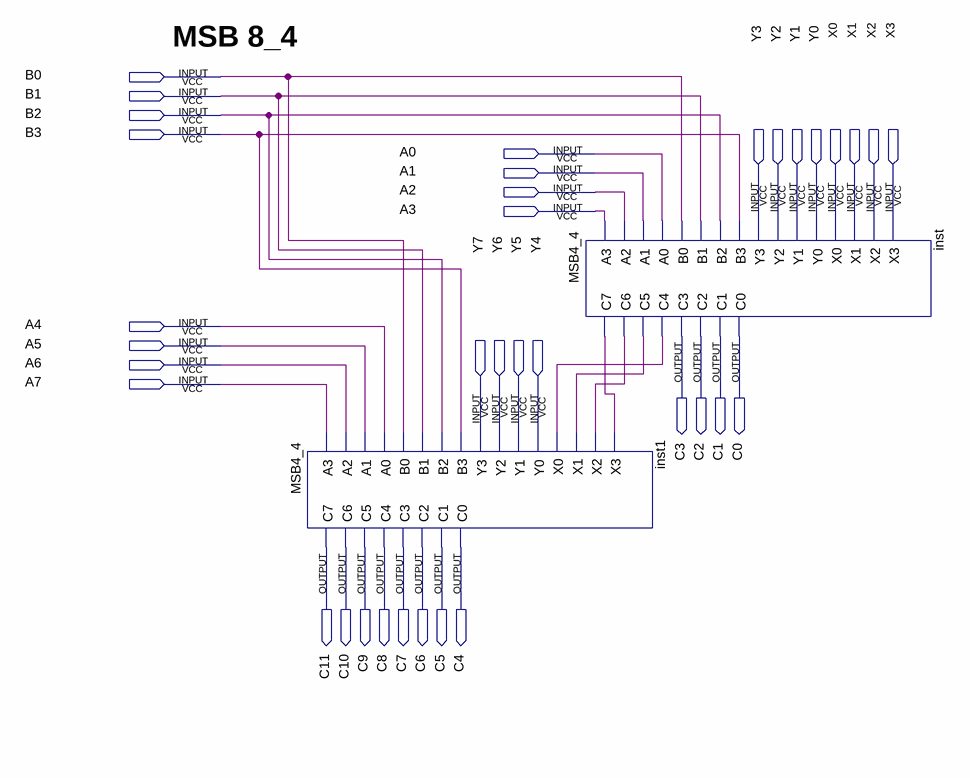
[diagram p0: schematic sheet]
// Quartus schematic MSB4_8.bdf as structural Verilog: 2 symbols, 36 pins
module MSB4_8 (
  input  B0,
  input  B1,
  input  B2,
  input  B3,
  input  A0,
  input  A1,
  input  A2,
  input  A3,
  input  Y3,
  input  Y2,
  input  Y1,
  input  Y0,
  input  X0,
  input  X1,
  input  X2,
  input  X3,
  input  A4,
  input  A5,
  input  A6,
  input  A7,
  input  Y7,
  input  Y6,
  input  Y5,
  input  Y4,
  output C3,
  output C2,
  output C1,
  output C0,
  output C11,
  output C10,
  output C9,
  output C8,
  output C7,
  output C6,
  output C5,
  output C4
);

  wire inst_c4, inst_c5, inst_c6, inst_c7;

  MSB4_4 inst1 (
    .A3(A7), .A2(A6), .A1(A5), .A0(A4), .B0(B0), .B1(B1), .B2(B2), .B3(B3), .Y3(Y7), .Y2(Y6), .Y1(Y5),
    .Y0(Y4), .X0(inst_c4), .X1(inst_c5), .X2(inst_c6), .X3(inst_c7), .C7(C11), .C6(C10), .C5(C9), .C4(C8),
    .C3(C7), .C2(C6), .C1(C5), .C0(C4));
  MSB4_4 inst (
    .A3(A3), .A2(A2), .A1(A1), .A0(A0), .B0(B0), .B1(B1), .B2(B2), .B3(B3), .Y3(Y3), .Y2(Y2), .Y1(Y1),
    .Y0(Y0), .X0(X0), .X1(X1), .X2(X2), .X3(X3), .C7(inst_c7), .C6(inst_c6), .C5(inst_c5), .C4(inst_c4),
    .C3(C3), .C2(C2), .C1(C1), .C0(C0));

  // Notes on the sheet:
  //   MSB 8_4
endmodule
